# EAGLE schematic uDJV_board_2_v1.1 (EAGLE 9.3.1)

## Sheet 1 of 5
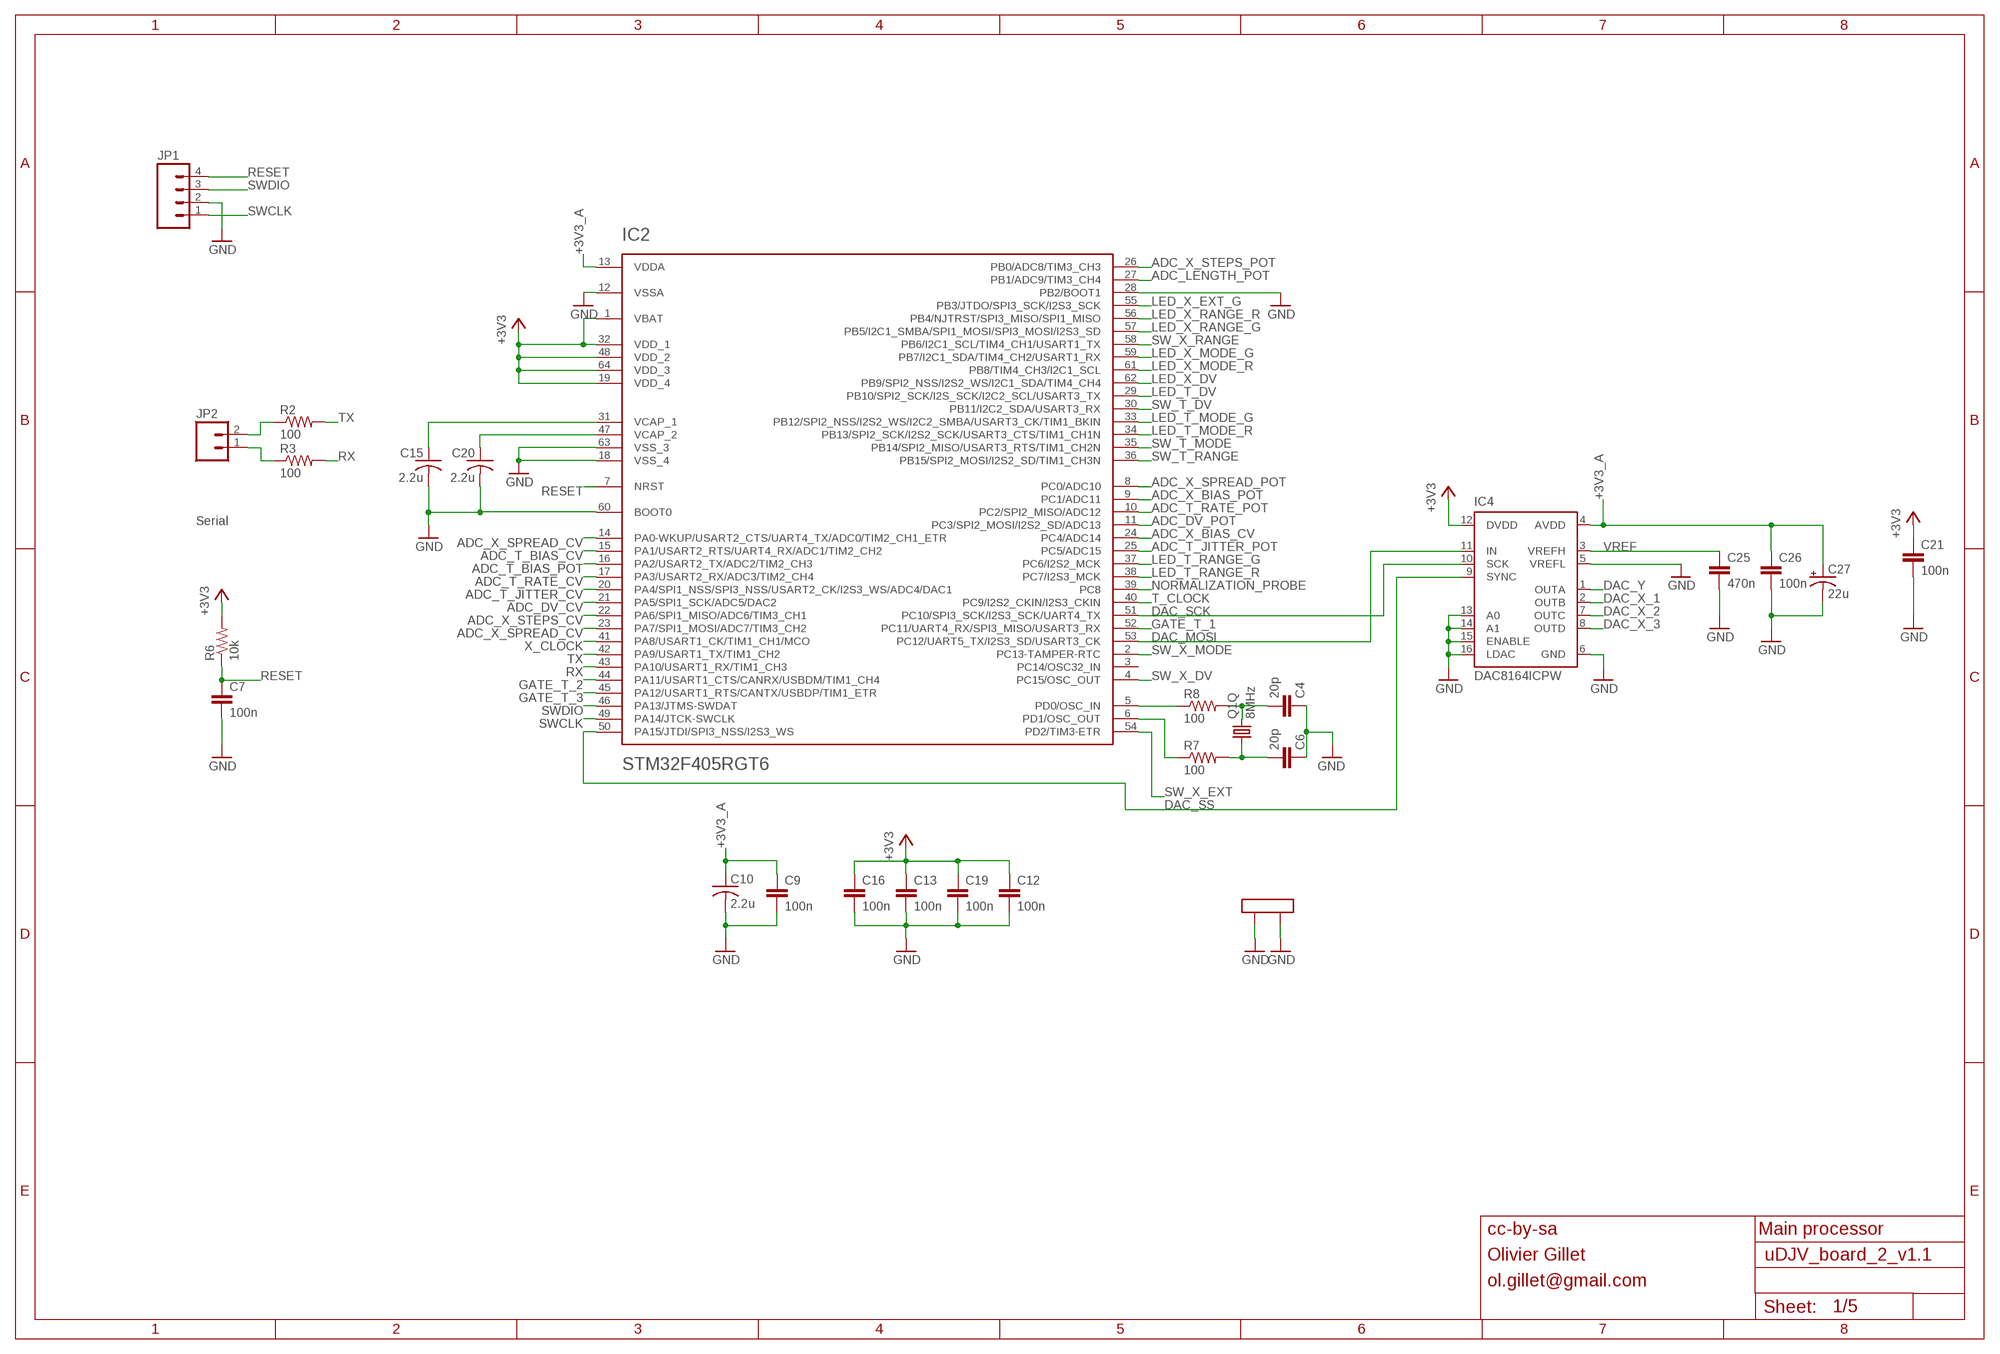
[diagram p0: schematic, sheet 1]

### Parts
C4  20p  PARTS_AMAN_CAPACITOR  [PARTS_AMAN_RESISTOR_0603]
C6  20p  PARTS_AMAN_CAPACITOR  [PARTS_AMAN_RESISTOR_0603]
C7  100n  PARTS_AMAN_CAPACITOR  [PARTS_AMAN_RESISTOR_0603]
C9  100n  PARTS_AMAN_CAPACITOR  [PARTS_AMAN_RESISTOR_0603]
C10  2.2u  C-USC0805  [C0805]
C12  100n  PARTS_AMAN_CAPACITOR  [PARTS_AMAN_RESISTOR_0603]
C13  100n  PARTS_AMAN_CAPACITOR  [PARTS_AMAN_RESISTOR_0603]
C15  2.2u  C-USC0805  [C0805]
C16  100n  PARTS_AMAN_CAPACITOR  [PARTS_AMAN_RESISTOR_0603]
C19  100n  PARTS_AMAN_CAPACITOR  [PARTS_AMAN_RESISTOR_0603]
C20  2.2u  C-USC0805  [C0805]
C21  100n  PARTS_AMAN_CAPACITOR  [PARTS_AMAN_RESISTOR_0603]
C25  470n  PARTS_AMAN_CAPACITOR  [PARTS_AMAN_RESISTOR_0603]
C26  100n  PARTS_AMAN_CAPACITOR  [PARTS_AMAN_RESISTOR_0603]
C27  22u  CPOL-USC  [PANASONIC_C]
IC2  STM32F405RGT6  STM32F20X  [TQFP-10X10-64]
IC4  DAC8164ICPW  DAC8564  [SOP65P640X110-16N]
JP1  M04PTH  [1X04]
JP2  M02PTH  [1X02]
Q1  8MHz  CRYSTAL  [CTS406]
R2  100  PARTS_AMAN_RESISTOR  [PARTS_AMAN_RESISTOR_0603]
R3  100  PARTS_AMAN_RESISTOR  [PARTS_AMAN_RESISTOR_0603]
R6  10k  PARTS_AMAN_RESISTOR  [PARTS_AMAN_RESISTOR_0603]
R7  100  PARTS_AMAN_RESISTOR  [PARTS_AMAN_RESISTOR_0603]
R8  100  PARTS_AMAN_RESISTOR  [PARTS_AMAN_RESISTOR_0603]

### Nets
+3V3: C12.1 C13.1 C16.1 C19.1 C21.1 IC2.1(VBAT) IC2.19(VDD_4) IC2.32(VDD_1) IC2.48(VDD_2) IC2.64(VDD_3) IC4.12(DVDD) R6.2 ; also sheet 3,5
+3V3_A: C9.1 C10.1 C26.1 C27.+ IC2.13(VDDA) IC4.4(AVDD) ; also sheet 2,3,5
ADC_DV_CV: IC2.21(PA5/SPI1_SCK/ADC5/DAC2) ; also sheet 3
ADC_DV_POT: IC2.11(PC3/SPI2_MOSI/I2S2_SD/ADC13) ; also sheet 2
ADC_LENGTH_POT: IC2.27(PB1/ADC9/TIM3_CH4) ; also sheet 2
ADC_T_BIAS_CV: IC2.15(PA1/USART2_RTS/UART4_RX/ADC1/TIM2_CH2) ; also sheet 3
ADC_T_BIAS_POT: IC2.16(PA2/USART2_TX/ADC2/TIM2_CH3) ; also sheet 2
ADC_T_JITTER_CV: IC2.20(PA4/SPI1_NSS/SPI3_NSS/USART2_CK/I2S3_WS/ADC4/DAC1) ; also sheet 3
ADC_T_JITTER_POT: IC2.25(PC5/ADC15) ; also sheet 2
ADC_T_RATE_CV: IC2.17(PA3/USART2_RX/ADC3/TIM2_CH4) ; also sheet 3
ADC_T_RATE_POT: IC2.10(PC2/SPI2_MISO/ADC12) ; also sheet 2
ADC_X_BIAS_CV: IC2.24(PC4/ADC14) ; also sheet 3
ADC_X_BIAS_POT: IC2.9(PC1/ADC11) ; also sheet 2
ADC_X_SPREAD_CV: IC2.14(PA0-WKUP/USART2_CTS/UART4_TX/ADC0/TIM2_CH1_ETR) IC2.23(PA7/SPI1_MOSI/ADC7/TIM3_CH2) ; also sheet 3
ADC_X_SPREAD_POT: IC2.8(PC0/ADC10) ; also sheet 2
ADC_X_STEPS_CV: IC2.22(PA6/SPI1_MISO/ADC6/TIM3_CH1) ; also sheet 3
ADC_X_STEPS_POT: IC2.26(PB0/ADC8/TIM3_CH3) ; also sheet 2
DAC_MOSI: IC2.53(PC12/UART5_TX/I2S3_SD/USART3_CK) IC4.11(IN)
DAC_SCK: IC2.51(PC10/SPI3_SCK/I2S3_SCK/UART4_TX) IC4.10(SCK)
DAC_SS: IC2.50(PA15/JTDI/SPI3_NSS/I2S3_WS) IC4.9(SYNC)
DAC_X_1: IC4.2(OUTB) ; also sheet 4
DAC_X_2: IC4.7(OUTC) ; also sheet 4
DAC_X_3: IC4.8(OUTD) ; also sheet 4
DAC_Y: IC4.1(OUTA) ; also sheet 4
GATE_T_1: IC2.52(PC11/UART4_RX/SPI3_MISO/USART3_RX) ; also sheet 4
GATE_T_2: IC2.44(PA11/USART1_CTS/CANRX/USBDM/TIM1_CH4) ; also sheet 4
GATE_T_3: IC2.45(PA12/USART1_RTS/CANTX/USBDP/TIM1_ETR) ; also sheet 4
GND: C4.1 C6.1 C7.2 C9.2 C10.2 C12.2 C13.2 C15.2 C16.2 C19.2 C20.2 C21.2 C25.2 C26.2 C27.- IC2.12(VSSA) IC2.18(VSS_4) IC2.28(PB2/BOOT1) IC2.60(BOOT0) IC2.63(VSS_3) IC4.5(VREFL) IC4.6(GND) IC4.13(A0) IC4.14(A1) IC4.15(ENABLE) IC4.16(LDAC) JP1.2 Q1.2(LID1) Q1.4(LID2) ; also sheet 2,3,4,5
LED_T_DV: IC2.29(PB10/SPI2_SCK/I2S_SCK/I2C2_SCL/USART3_TX) ; also sheet 2
LED_T_MODE_G: IC2.33(PB12/SPI2_NSS/I2S2_WS/I2C2_SMBA/USART3_CK/TIM1_BKIN) ; also sheet 2
LED_T_MODE_R: IC2.34(PB13/SPI2_SCK/I2S2_SCK/USART3_CTS/TIM1_CH1N) ; also sheet 2
LED_T_RANGE_G: IC2.37(PC6/I2S2_MCK) ; also sheet 2
LED_T_RANGE_R: IC2.38(PC7/I2S3_MCK) ; also sheet 2
LED_X_DV: IC2.62(PB9/SPI2_NSS/I2S2_WS/I2C1_SDA/TIM4_CH4) ; also sheet 2
LED_X_EXT_G: IC2.55(PB3/JTDO/SPI3_SCK/I2S3_SCK) ; also sheet 2
LED_X_MODE_G: IC2.59(PB7/I2C1_SDA/TIM4_CH2/USART1_RX) ; also sheet 2
LED_X_MODE_R: IC2.61(PB8/TIM4_CH3/I2C1_SCL) ; also sheet 2
LED_X_RANGE_G: IC2.57(PB5/I2C1_SMBA/SPI1_MOSI/SPI3_MOSI/I2S3_SD) ; also sheet 2
LED_X_RANGE_R: IC2.56(PB4/NJTRST/SPI3_MISO/SPI1_MISO) ; also sheet 2
N$7: IC2.6(PD1/OSC_OUT) R7.1
N$8: IC2.5(PD0/OSC_IN) R8.1
N$13: C20.1 IC2.47(VCAP_2)
N$19: C15.1 IC2.31(VCAP_1)
N$33: JP2.2 R2.1
N$51: JP2.1 R3.1
N$62: C4.2 Q1.3 R8.2
N$65: C6.2 Q1.1 R7.2
NORMALIZATION_PROBE: IC2.39(PC8) ; also sheet 3
RESET: C7.1 IC2.7(NRST) JP1.4 R6.1
RX: IC2.43(PA10/USART1_RX/TIM1_CH3) R3.2
SW_T_DV: IC2.30(PB11/I2C2_SDA/USART3_RX) ; also sheet 2
SW_T_MODE: IC2.35(PB14/SPI2_MISO/USART3_RTS/TIM1_CH2N) ; also sheet 2
SW_T_RANGE: IC2.36(PB15/SPI2_MOSI/I2S2_SD/TIM1_CH3N) ; also sheet 2
SW_X_DV: IC2.4(PC15/OSC_OUT) ; also sheet 2
SW_X_EXT: IC2.54(PD2/TIM3-ETR) ; also sheet 2
SW_X_MODE: IC2.2(PC13-TAMPER-RTC) ; also sheet 2
SW_X_RANGE: IC2.58(PB6/I2C1_SCL/TIM4_CH1/USART1_TX) ; also sheet 2
SWCLK: IC2.49(PA14/JTCK-SWCLK) JP1.1
SWDIO: IC2.46(PA13/JTMS-SWDAT) JP1.3
T_CLOCK: IC2.40(PC9/I2S2_CKIN/I2S3_CKIN) ; also sheet 3
TX: IC2.42(PA9/USART1_TX/TIM1_CH2) R2.2
VREF: C25.1 IC4.3(VREFH) ; also sheet 4
X_CLOCK: IC2.41(PA8/USART1_CK/TIM1_CH1/MCO) ; also sheet 3
Unconnected: IC2.3(PC14/OSC32_IN)

### Notes on the sheet
- Serial
- cc-by-sa | Main processor
- Olivier Gillet
- ol.gillet@gmail.com

## Sheet 2 of 5
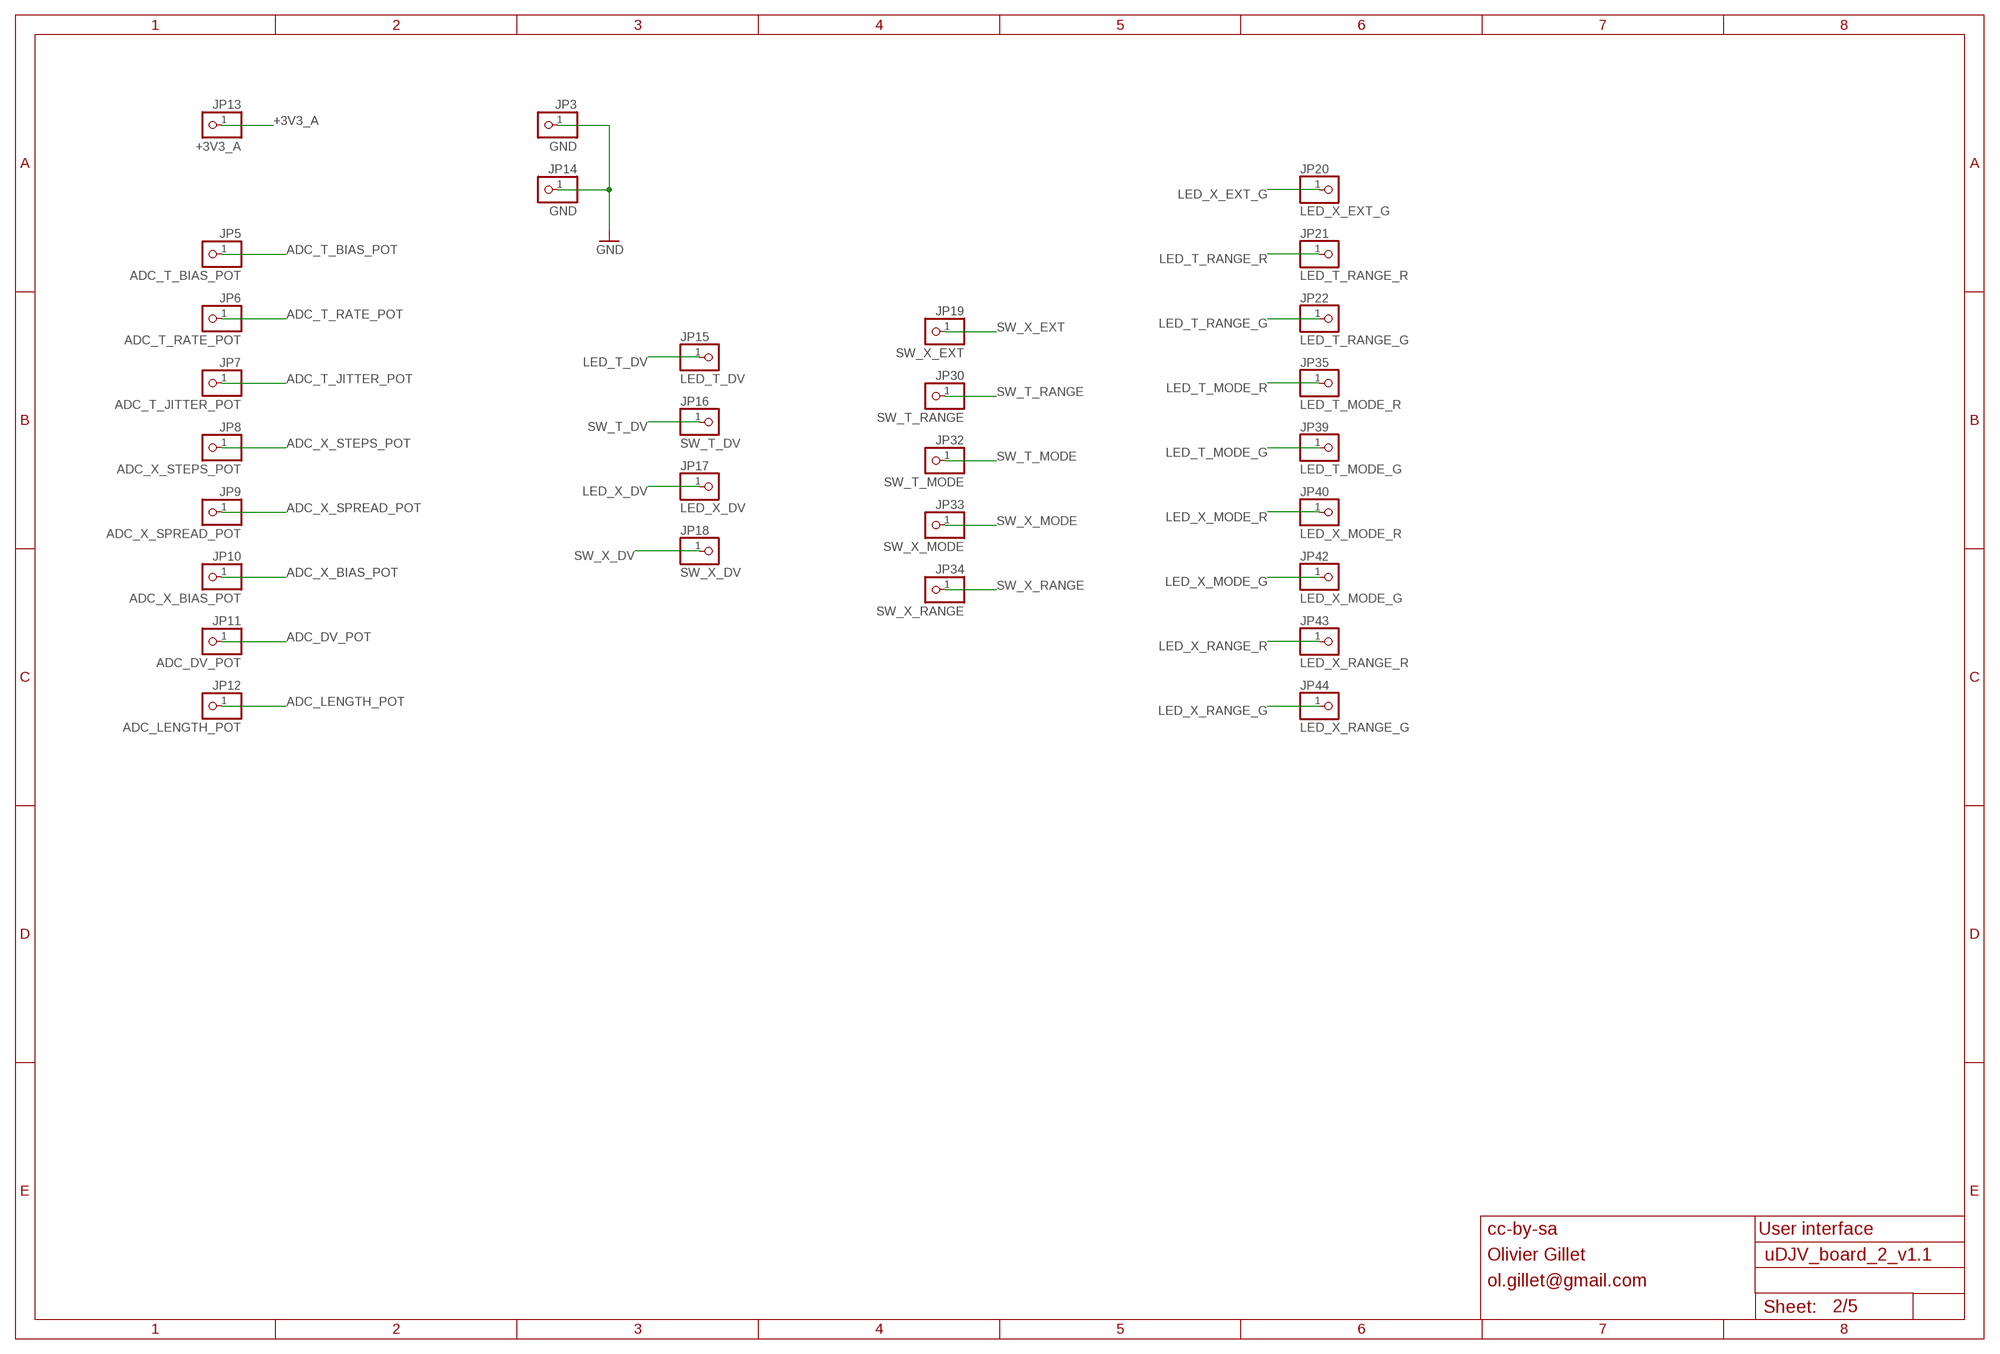
[diagram p1: schematic, sheet 2]

### Parts
JP3  GND  PARTS_AMAN_PINHD-1X1  [PARTS_AMAN_1X01]
JP5  ADC_T_BIAS_POT  PARTS_AMAN_PINHD-1X1  [PARTS_AMAN_1X01]
JP6  ADC_T_RATE_POT  PARTS_AMAN_PINHD-1X1  [PARTS_AMAN_1X01]
JP7  ADC_T_JITTER_POT  PARTS_AMAN_PINHD-1X1  [PARTS_AMAN_1X01]
JP8  ADC_X_STEPS_POT  PARTS_AMAN_PINHD-1X1  [PARTS_AMAN_1X01]
JP9  ADC_X_SPREAD_POT  PARTS_AMAN_PINHD-1X1  [PARTS_AMAN_1X01]
JP10  ADC_X_BIAS_POT  PARTS_AMAN_PINHD-1X1  [PARTS_AMAN_1X01]
JP11  ADC_DV_POT  PARTS_AMAN_PINHD-1X1  [PARTS_AMAN_1X01]
JP12  ADC_LENGTH_POT  PARTS_AMAN_PINHD-1X1  [PARTS_AMAN_1X01]
JP13  +3V3_A  PARTS_AMAN_PINHD-1X1  [PARTS_AMAN_1X01]
JP14  GND  PARTS_AMAN_PINHD-1X1  [PARTS_AMAN_1X01]
JP15  LED_T_DV  PARTS_AMAN_PINHD-1X1  [PARTS_AMAN_1X01]
JP16  SW_T_DV  PARTS_AMAN_PINHD-1X1  [PARTS_AMAN_1X01]
JP17  LED_X_DV  PARTS_AMAN_PINHD-1X1  [PARTS_AMAN_1X01]
JP18  SW_X_DV  PARTS_AMAN_PINHD-1X1  [PARTS_AMAN_1X01]
JP19  SW_X_EXT  PARTS_AMAN_PINHD-1X1  [PARTS_AMAN_1X01]
JP20  LED_X_EXT_G  PARTS_AMAN_PINHD-1X1  [PARTS_AMAN_1X01]
JP21  LED_T_RANGE_R  PARTS_AMAN_PINHD-1X1  [PARTS_AMAN_1X01]
JP22  LED_T_RANGE_G  PARTS_AMAN_PINHD-1X1  [PARTS_AMAN_1X01]
JP30  SW_T_RANGE  PARTS_AMAN_PINHD-1X1  [PARTS_AMAN_1X01]
JP32  SW_T_MODE  PARTS_AMAN_PINHD-1X1  [PARTS_AMAN_1X01]
JP33  SW_X_MODE  PARTS_AMAN_PINHD-1X1  [PARTS_AMAN_1X01]
JP34  SW_X_RANGE  PARTS_AMAN_PINHD-1X1  [PARTS_AMAN_1X01]
JP35  LED_T_MODE_R  PARTS_AMAN_PINHD-1X1  [PARTS_AMAN_1X01]
JP39  LED_T_MODE_G  PARTS_AMAN_PINHD-1X1  [PARTS_AMAN_1X01]
JP40  LED_X_MODE_R  PARTS_AMAN_PINHD-1X1  [PARTS_AMAN_1X01]
JP42  LED_X_MODE_G  PARTS_AMAN_PINHD-1X1  [PARTS_AMAN_1X01]
JP43  LED_X_RANGE_R  PARTS_AMAN_PINHD-1X1  [PARTS_AMAN_1X01]
JP44  LED_X_RANGE_G  PARTS_AMAN_PINHD-1X1  [PARTS_AMAN_1X01]

### Nets
+3V3_A: JP13.1 ; also sheet 1,3,5
ADC_DV_POT: JP11.1 ; also sheet 1
ADC_LENGTH_POT: JP12.1 ; also sheet 1
ADC_T_BIAS_POT: JP5.1 ; also sheet 1
ADC_T_JITTER_POT: JP7.1 ; also sheet 1
ADC_T_RATE_POT: JP6.1 ; also sheet 1
ADC_X_BIAS_POT: JP10.1 ; also sheet 1
ADC_X_SPREAD_POT: JP9.1 ; also sheet 1
ADC_X_STEPS_POT: JP8.1 ; also sheet 1
GND: JP3.1 JP14.1 ; also sheet 1,3,4,5
LED_T_DV: JP15.1 ; also sheet 1
LED_T_MODE_G: JP39.1 ; also sheet 1
LED_T_MODE_R: JP35.1 ; also sheet 1
LED_T_RANGE_G: JP22.1 ; also sheet 1
LED_T_RANGE_R: JP21.1 ; also sheet 1
LED_X_DV: JP17.1 ; also sheet 1
LED_X_EXT_G: JP20.1 ; also sheet 1
LED_X_MODE_G: JP42.1 ; also sheet 1
LED_X_MODE_R: JP40.1 ; also sheet 1
LED_X_RANGE_G: JP44.1 ; also sheet 1
LED_X_RANGE_R: JP43.1 ; also sheet 1
SW_T_DV: JP16.1 ; also sheet 1
SW_T_MODE: JP32.1 ; also sheet 1
SW_T_RANGE: JP30.1 ; also sheet 1
SW_X_DV: JP18.1 ; also sheet 1
SW_X_EXT: JP19.1 ; also sheet 1
SW_X_MODE: JP33.1 ; also sheet 1
SW_X_RANGE: JP34.1 ; also sheet 1

### Notes on the sheet
- cc-by-sa | User interface
- Olivier Gillet
- ol.gillet@gmail.com

## Sheet 3 of 5
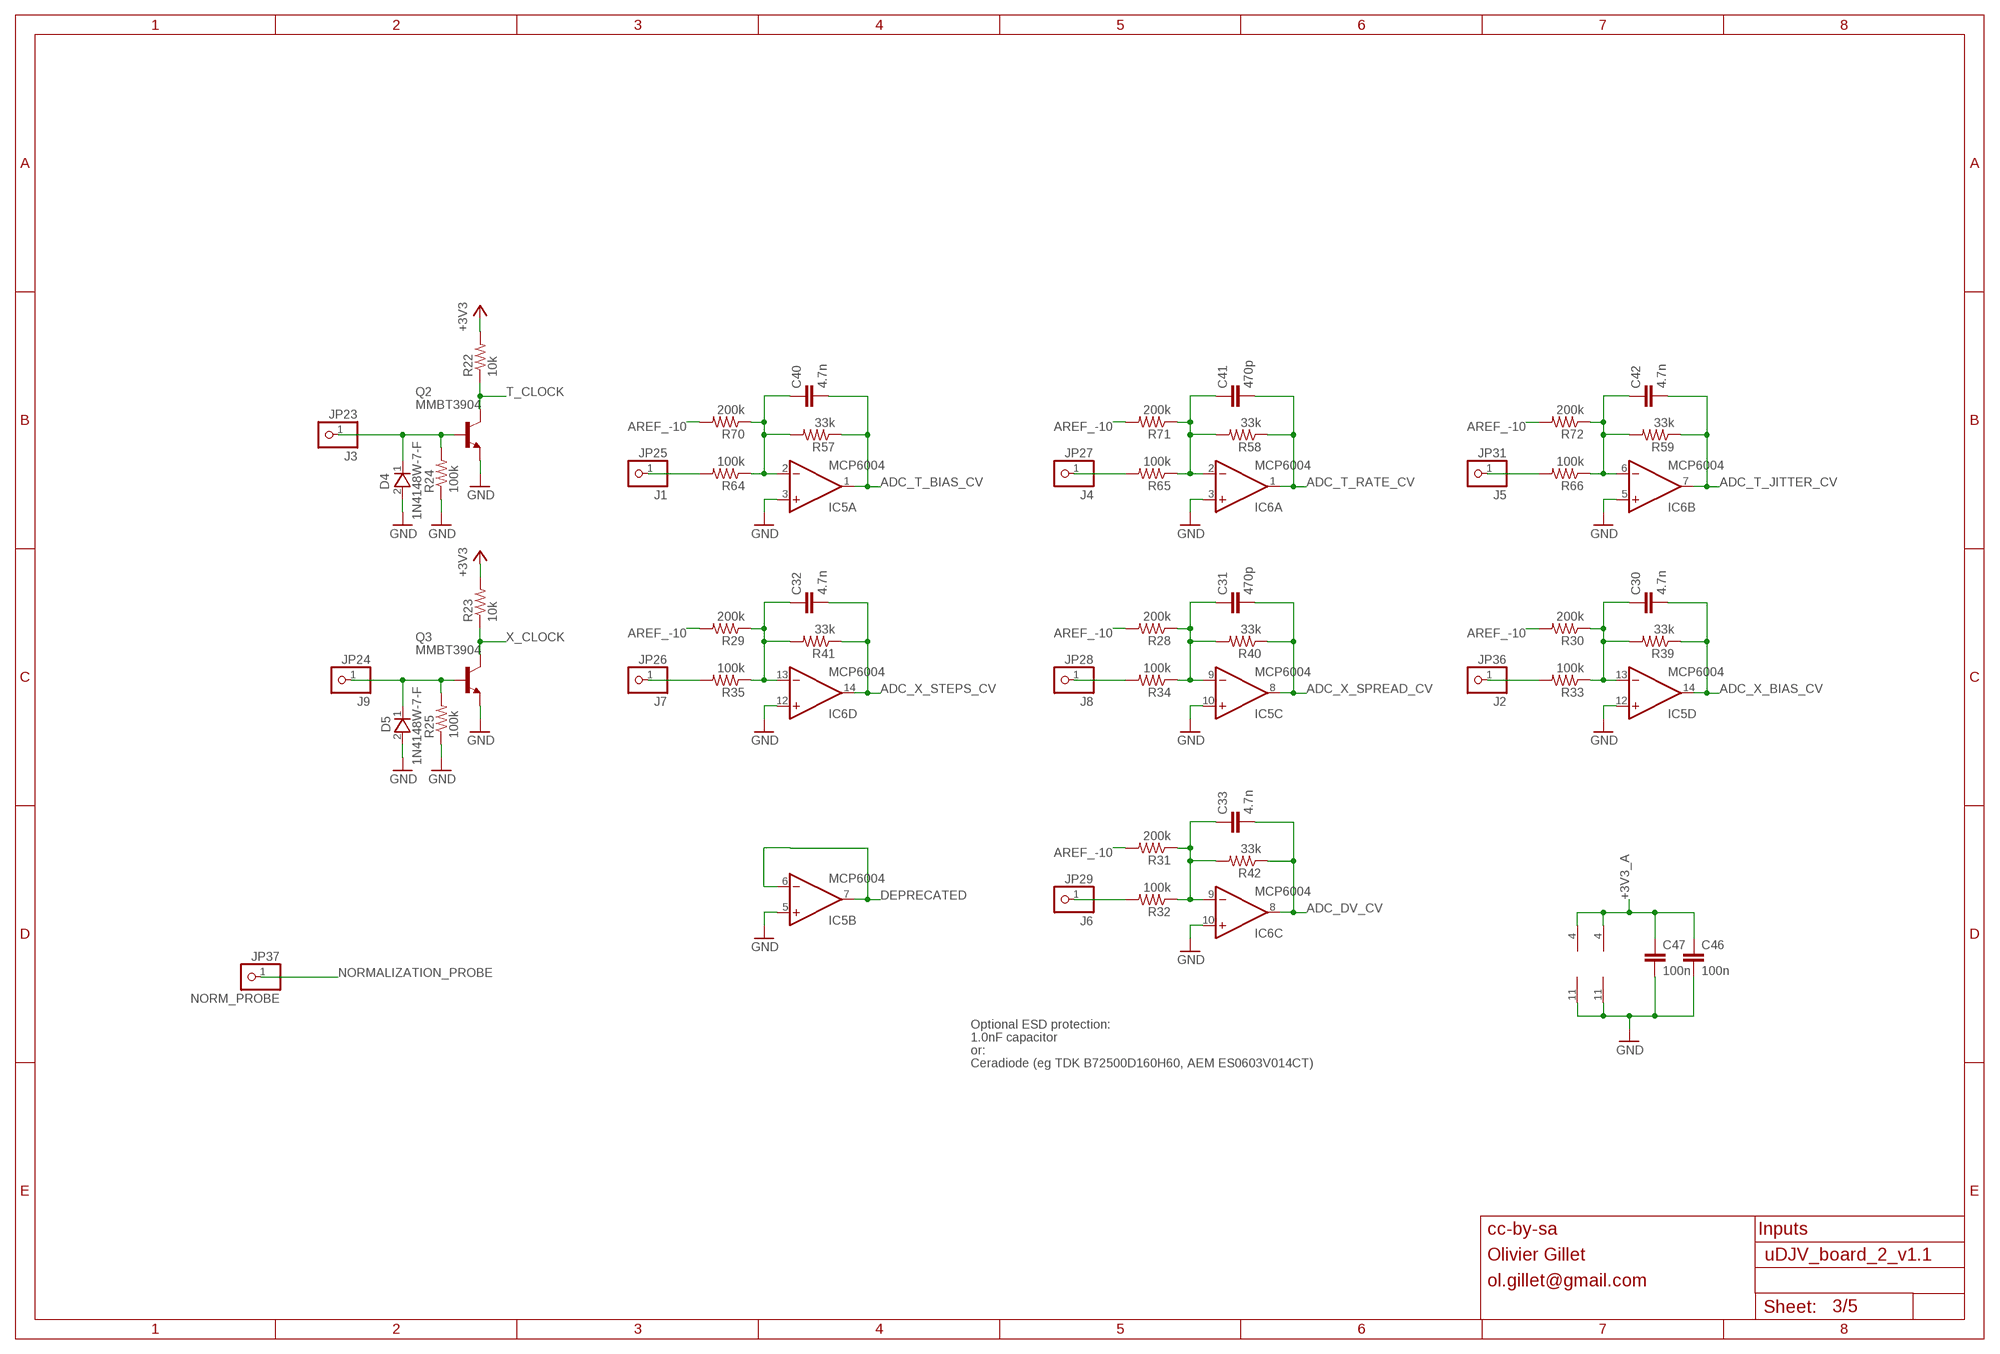
[diagram p2: schematic, sheet 3]

### Parts
C30  4.7n  PARTS_AMAN_CAPACITOR  [PARTS_AMAN_RESISTOR_0603]
C31  470p  PARTS_AMAN_CAPACITOR  [PARTS_AMAN_RESISTOR_0603]
C32  4.7n  PARTS_AMAN_CAPACITOR  [PARTS_AMAN_RESISTOR_0603]
C33  4.7n  PARTS_AMAN_CAPACITOR  [PARTS_AMAN_RESISTOR_0603]
C40  4.7n  PARTS_AMAN_CAPACITOR  [PARTS_AMAN_RESISTOR_0603]
C41  470p  PARTS_AMAN_CAPACITOR  [PARTS_AMAN_RESISTOR_0603]
C42  4.7n  PARTS_AMAN_CAPACITOR  [PARTS_AMAN_RESISTOR_0603]
C46  100n  PARTS_AMAN_CAPACITOR  [PARTS_AMAN_RESISTOR_0603]
C47  100n  PARTS_AMAN_CAPACITOR  [PARTS_AMAN_RESISTOR_0603]
D4  1N4148W-7-F  [SOD3716X115N]
D5  1N4148W-7-F  [SOD3716X115N]
IC5  MCP6004  TL074PW  [TSSOP14_065]
IC6  MCP6004  TL074PW  [TSSOP14_065]
JP23  J3  PARTS_AMAN_PINHD-1X1  [PARTS_AMAN_1X01]
JP24  J9  PARTS_AMAN_PINHD-1X1  [PARTS_AMAN_1X01]
JP25  J1  PARTS_AMAN_PINHD-1X1  [PARTS_AMAN_1X01]
JP26  J7  PARTS_AMAN_PINHD-1X1  [PARTS_AMAN_1X01]
JP27  J4  PARTS_AMAN_PINHD-1X1  [PARTS_AMAN_1X01]
JP28  J8  PARTS_AMAN_PINHD-1X1  [PARTS_AMAN_1X01]
JP29  J6  PARTS_AMAN_PINHD-1X1  [PARTS_AMAN_1X01]
JP31  J5  PARTS_AMAN_PINHD-1X1  [PARTS_AMAN_1X01]
JP36  J2  PARTS_AMAN_PINHD-1X1  [PARTS_AMAN_1X01]
JP37  NORM_PROBE  PARTS_AMAN_PINHD-1X1  [PARTS_AMAN_1X01]
Q2  MMBT3904  MMBT3904LT1-NPN-SOT23-BEC  [SOT23-BEC]
Q3  MMBT3904  MMBT3904LT1-NPN-SOT23-BEC  [SOT23-BEC]
R22  10k  PARTS_AMAN_RESISTOR  [PARTS_AMAN_RESISTOR_0603]
R23  10k  PARTS_AMAN_RESISTOR  [PARTS_AMAN_RESISTOR_0603]
R24  100k  PARTS_AMAN_RESISTOR  [PARTS_AMAN_RESISTOR_0603]
R25  100k  PARTS_AMAN_RESISTOR  [PARTS_AMAN_RESISTOR_0603]
R28  200k  PARTS_AMAN_RESISTOR  [PARTS_AMAN_RESISTOR_0603]
R29  200k  PARTS_AMAN_RESISTOR  [PARTS_AMAN_RESISTOR_0603]
R30  200k  PARTS_AMAN_RESISTOR  [PARTS_AMAN_RESISTOR_0603]
R31  200k  PARTS_AMAN_RESISTOR  [PARTS_AMAN_RESISTOR_0603]
R32  100k  PARTS_AMAN_RESISTOR  [PARTS_AMAN_RESISTOR_0603]
R33  100k  PARTS_AMAN_RESISTOR  [PARTS_AMAN_RESISTOR_0603]
R34  100k  PARTS_AMAN_RESISTOR  [PARTS_AMAN_RESISTOR_0603]
R35  100k  PARTS_AMAN_RESISTOR  [PARTS_AMAN_RESISTOR_0603]
R39  33k  PARTS_AMAN_RESISTOR  [PARTS_AMAN_RESISTOR_0603]
R40  33k  PARTS_AMAN_RESISTOR  [PARTS_AMAN_RESISTOR_0603]
R41  33k  PARTS_AMAN_RESISTOR  [PARTS_AMAN_RESISTOR_0603]
R42  33k  PARTS_AMAN_RESISTOR  [PARTS_AMAN_RESISTOR_0603]
R57  33k  PARTS_AMAN_RESISTOR  [PARTS_AMAN_RESISTOR_0603]
R58  33k  PARTS_AMAN_RESISTOR  [PARTS_AMAN_RESISTOR_0603]
R59  33k  PARTS_AMAN_RESISTOR  [PARTS_AMAN_RESISTOR_0603]
R64  100k  PARTS_AMAN_RESISTOR  [PARTS_AMAN_RESISTOR_0603]
R65  100k  PARTS_AMAN_RESISTOR  [PARTS_AMAN_RESISTOR_0603]
R66  100k  PARTS_AMAN_RESISTOR  [PARTS_AMAN_RESISTOR_0603]
R70  200k  PARTS_AMAN_RESISTOR  [PARTS_AMAN_RESISTOR_0603]
R71  200k  PARTS_AMAN_RESISTOR  [PARTS_AMAN_RESISTOR_0603]
R72  200k  PARTS_AMAN_RESISTOR  [PARTS_AMAN_RESISTOR_0603]

### Nets
+3V3: R22.2 R23.2 ; also sheet 1,5
+3V3_A: C46.1 C47.1 IC5.4(P:V+) IC6.4(P:V+) ; also sheet 1,2,5
ADC_DV_CV: C33.2 IC6.8(C:OUT) R42.1 ; also sheet 1
ADC_T_BIAS_CV: C40.2 IC5.1(A:OUT) R57.1 ; also sheet 1
ADC_T_JITTER_CV: C42.2 IC6.7(B:OUT) R59.1 ; also sheet 1
ADC_T_RATE_CV: C41.2 IC6.1(A:OUT) R58.1 ; also sheet 1
ADC_X_BIAS_CV: C30.2 IC5.14(D:OUT) R39.1 ; also sheet 1
ADC_X_SPREAD_CV: C31.2 IC5.8(C:OUT) R40.1 ; also sheet 1
ADC_X_STEPS_CV: C32.2 IC6.14(D:OUT) R41.1 ; also sheet 1
AREF_-10: R28.2 R29.2 R30.2 R31.2 R70.2 R71.2 R72.2 ; also sheet 5
DEPRECATED: IC5.6(B:-IN) IC5.7(B:OUT)
GND: C46.2 C47.2 D4.2(A) D5.2(A) IC5.3(A:+IN) IC5.5(B:+IN) IC5.10(C:+IN) IC5.11(P:V-) IC5.12(D:+IN) IC6.3(A:+IN) IC6.5(B:+IN) IC6.10(C:+IN) IC6.11(P:V-) IC6.12(D:+IN) Q2.E Q3.E R24.1 R25.1 ; also sheet 1,2,4,5
MORPH_IN: JP25.1 R64.2
MORPH_IN1: JP26.1 R35.2
MORPH_IN3: JP27.1 R65.2
MORPH_IN4: JP28.1 R34.2
MORPH_IN5: JP29.1 R32.2
MORPH_IN6: JP31.1 R66.2
MORPH_IN7: JP36.1 R33.2
N$5: C41.1 IC6.2(A:-IN) R58.2 R65.1 R71.1
N$11: C40.1 IC5.2(A:-IN) R57.2 R64.1 R70.1
N$15: C42.1 IC6.6(B:-IN) R59.2 R66.1 R72.1
N$17: C31.1 IC5.9(C:-IN) R28.1 R34.1 R40.2
N$25: C30.1 IC5.13(D:-IN) R30.1 R33.1 R39.2
N$27: C32.1 IC6.13(D:-IN) R29.1 R35.1 R41.2
N$31: C33.1 IC6.9(C:-IN) R31.1 R32.1 R42.2
N$50: D4.1(K) JP23.1 Q2.B R24.2
N$52: D5.1(K) JP24.1 Q3.B R25.2
NORMALIZATION_PROBE: JP37.1 ; also sheet 1
T_CLOCK: Q2.C R22.1 ; also sheet 1
X_CLOCK: Q3.C R23.1 ; also sheet 1

### Notes on the sheet
- Optional ESD protection:
- 1.0nF capacitor
- or:
- Ceradiode (eg TDK B72500D160H60, AEM ES0603V014CT)
- cc-by-sa | Inputs
- Olivier Gillet
- ol.gillet@gmail.com

## Sheet 4 of 5
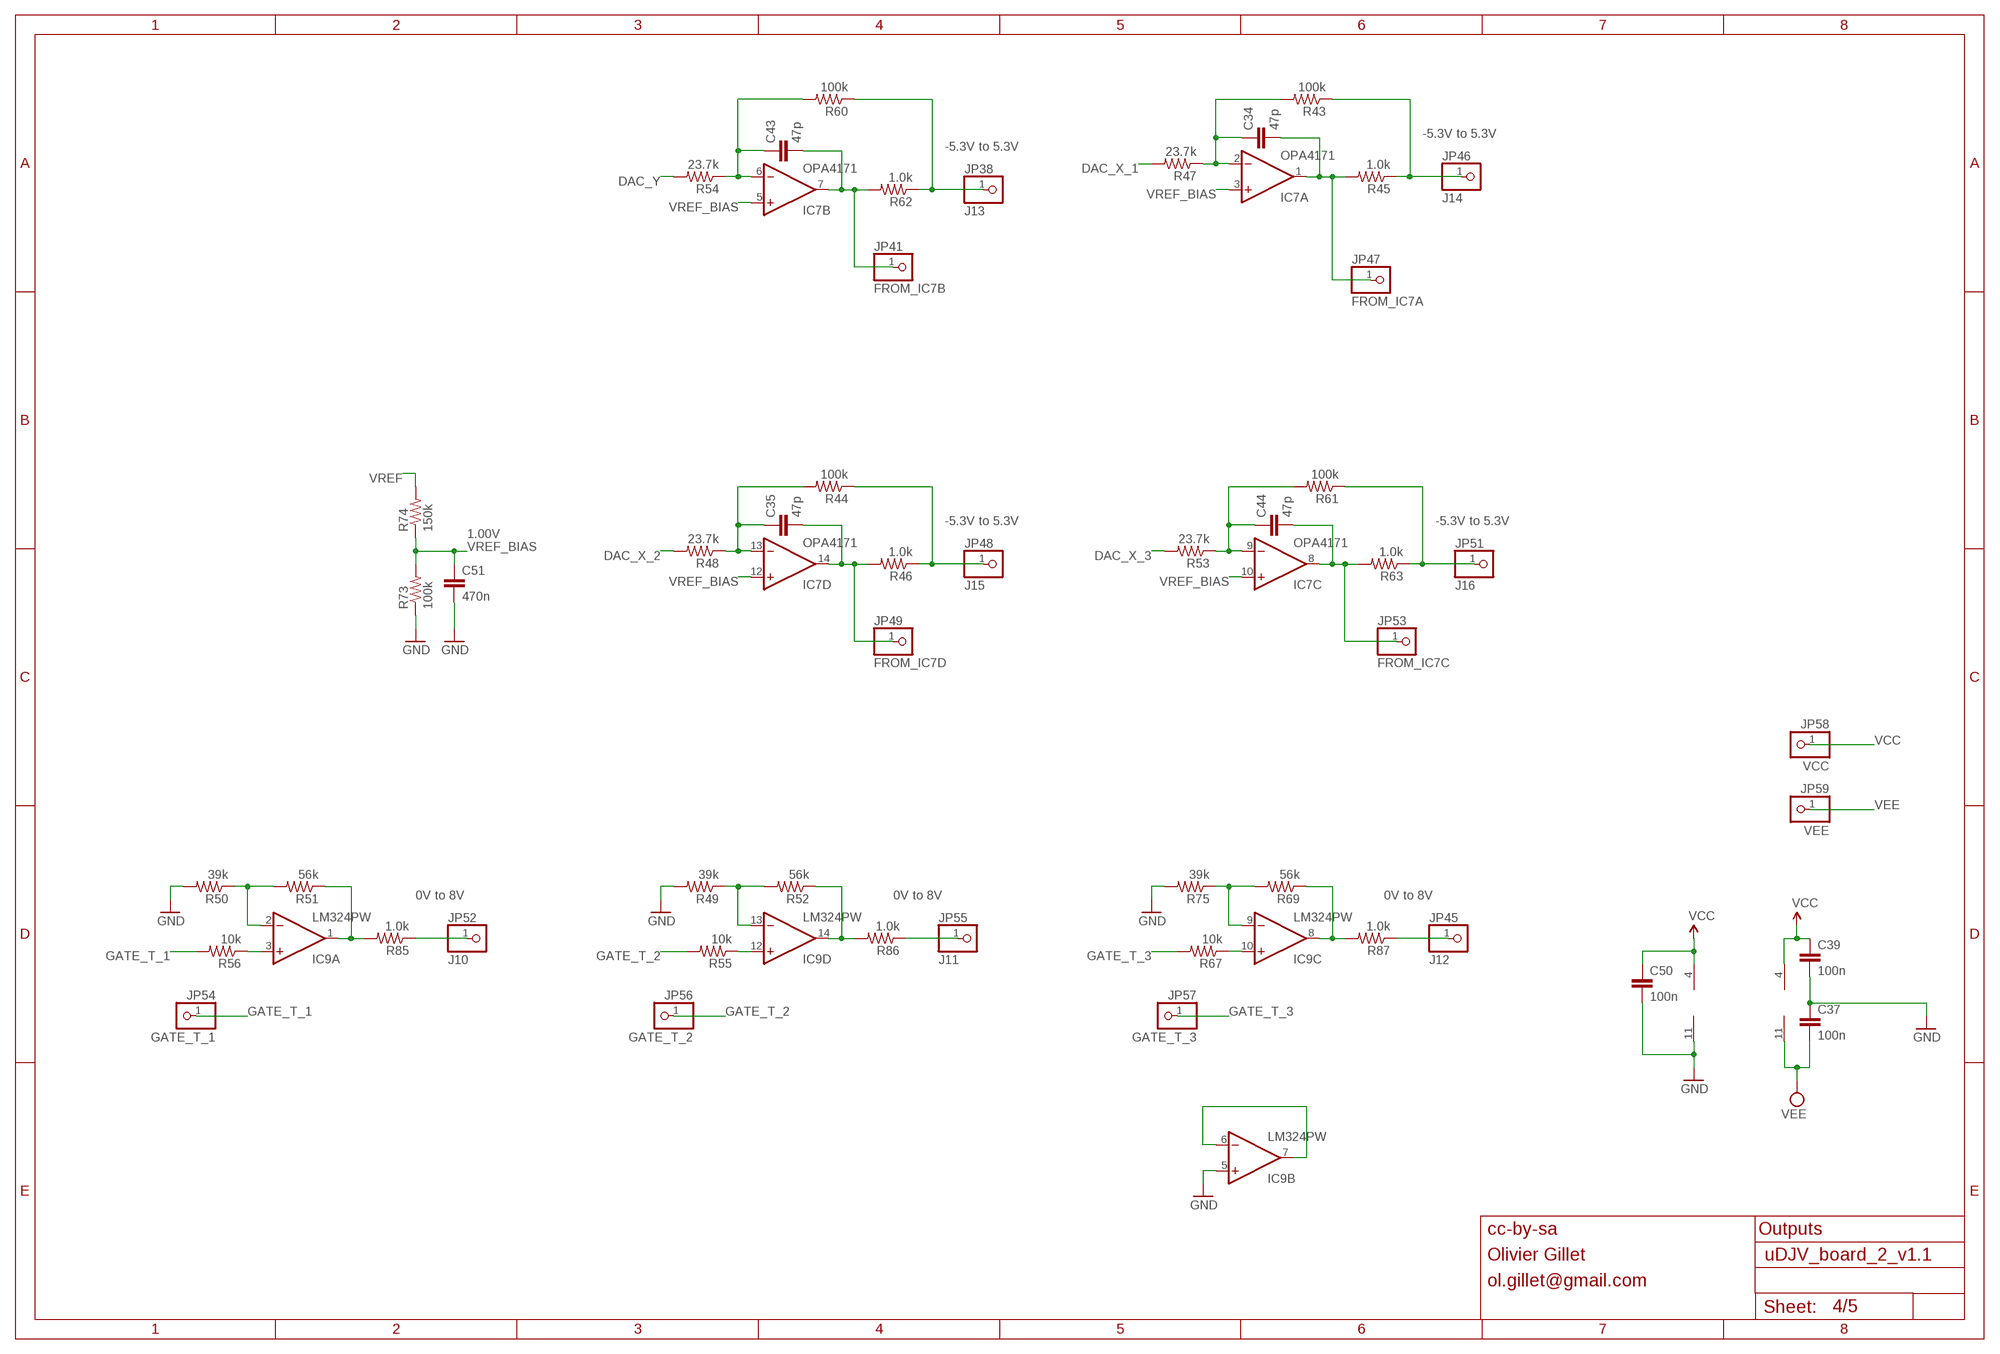
[diagram p3: schematic, sheet 4]

### Parts
C34  47p  PARTS_AMAN_CAPACITOR  [PARTS_AMAN_RESISTOR_0603]
C35  47p  PARTS_AMAN_CAPACITOR  [PARTS_AMAN_RESISTOR_0603]
C37  100n  PARTS_AMAN_CAPACITOR  [PARTS_AMAN_RESISTOR_0603]
C39  100n  PARTS_AMAN_CAPACITOR  [PARTS_AMAN_RESISTOR_0603]
C43  47p  PARTS_AMAN_CAPACITOR  [PARTS_AMAN_RESISTOR_0603]
C44  47p  PARTS_AMAN_CAPACITOR  [PARTS_AMAN_RESISTOR_0603]
C50  100n  PARTS_AMAN_CAPACITOR  [PARTS_AMAN_RESISTOR_0603]
C51  470n  PARTS_AMAN_CAPACITOR  [PARTS_AMAN_RESISTOR_0603]
IC7  OPA4171  TL074PW  [TSSOP14_065]
IC9  LM324PW  TL074PW  [TSSOP14_065]
JP38  J13  PARTS_AMAN_PINHD-1X1  [PARTS_AMAN_1X01]
JP41  FROM_IC7B  PARTS_AMAN_PINHD-1X1  [PARTS_AMAN_1X01]
JP45  J12  PARTS_AMAN_PINHD-1X1  [PARTS_AMAN_1X01]
JP46  J14  PARTS_AMAN_PINHD-1X1  [PARTS_AMAN_1X01]
JP47  FROM_IC7A  PARTS_AMAN_PINHD-1X1  [PARTS_AMAN_1X01]
JP48  J15  PARTS_AMAN_PINHD-1X1  [PARTS_AMAN_1X01]
JP49  FROM_IC7D  PARTS_AMAN_PINHD-1X1  [PARTS_AMAN_1X01]
JP51  J16  PARTS_AMAN_PINHD-1X1  [PARTS_AMAN_1X01]
JP52  J10  PARTS_AMAN_PINHD-1X1  [PARTS_AMAN_1X01]
JP53  FROM_IC7C  PARTS_AMAN_PINHD-1X1  [PARTS_AMAN_1X01]
JP54  GATE_T_1  PARTS_AMAN_PINHD-1X1  [PARTS_AMAN_1X01]
JP55  J11  PARTS_AMAN_PINHD-1X1  [PARTS_AMAN_1X01]
JP56  GATE_T_2  PARTS_AMAN_PINHD-1X1  [PARTS_AMAN_1X01]
JP57  GATE_T_3  PARTS_AMAN_PINHD-1X1  [PARTS_AMAN_1X01]
JP58  VCC  PARTS_AMAN_PINHD-1X1  [PARTS_AMAN_1X01]
JP59  VEE  PARTS_AMAN_PINHD-1X1  [PARTS_AMAN_1X01]
R43  100k  PARTS_AMAN_RESISTOR  [PARTS_AMAN_RESISTOR_0603]
R44  100k  PARTS_AMAN_RESISTOR  [PARTS_AMAN_RESISTOR_0603]
R45  1.0k  PARTS_AMAN_RESISTOR  [PARTS_AMAN_RESISTOR_0603]
R46  1.0k  R-US_R0603  [R0603]
R47  23.7k  PARTS_AMAN_RESISTOR  [PARTS_AMAN_RESISTOR_0603]
R48  23.7k  PARTS_AMAN_RESISTOR  [PARTS_AMAN_RESISTOR_0603]
R49  39k  PARTS_AMAN_RESISTOR  [PARTS_AMAN_RESISTOR_0603]
R50  39k  PARTS_AMAN_RESISTOR  [PARTS_AMAN_RESISTOR_0603]
R51  56k  PARTS_AMAN_RESISTOR  [PARTS_AMAN_RESISTOR_0603]
R52  56k  PARTS_AMAN_RESISTOR  [PARTS_AMAN_RESISTOR_0603]
R53  23.7k  PARTS_AMAN_RESISTOR  [PARTS_AMAN_RESISTOR_0603]
R54  23.7k  PARTS_AMAN_RESISTOR  [PARTS_AMAN_RESISTOR_0603]
R55  10k  PARTS_AMAN_RESISTOR  [PARTS_AMAN_RESISTOR_0603]
R56  10k  PARTS_AMAN_RESISTOR  [PARTS_AMAN_RESISTOR_0603]
R60  100k  PARTS_AMAN_RESISTOR  [PARTS_AMAN_RESISTOR_0603]
R61  100k  PARTS_AMAN_RESISTOR  [PARTS_AMAN_RESISTOR_0603]
R62  1.0k  R-US_R0603  [R0603]
R63  1.0k  R-US_R0603  [R0603]
R67  10k  PARTS_AMAN_RESISTOR  [PARTS_AMAN_RESISTOR_0603]
R69  56k  PARTS_AMAN_RESISTOR  [PARTS_AMAN_RESISTOR_0603]
R73  100k  PARTS_AMAN_RESISTOR  [PARTS_AMAN_RESISTOR_0603]
R74  150k  PARTS_AMAN_RESISTOR  [PARTS_AMAN_RESISTOR_0603]
R75  39k  PARTS_AMAN_RESISTOR  [PARTS_AMAN_RESISTOR_0603]
R85  1.0k  R-US_R0603  [R0603]
R86  1.0k  R-US_R0603  [R0603]
R87  1.0k  R-US_R0603  [R0603]

### Nets
DAC_X_1: R47.2 ; also sheet 1
DAC_X_2: R48.2 ; also sheet 1
DAC_X_3: R53.2 ; also sheet 1
DAC_Y: R54.2 ; also sheet 1
GATE_T_1: JP54.1 R56.2 ; also sheet 1
GATE_T_2: JP56.1 R55.2 ; also sheet 1
GATE_T_3: JP57.1 R67.2 ; also sheet 1
GND: C37.1 C39.2 C50.2 C51.2 IC9.5(B:+IN) IC9.11(P:V-) R49.2 R50.2 R73.1 R75.2 ; also sheet 1,2,3,5
N$3: IC9.12(D:+IN) R55.1
N$14: IC9.1(A:OUT) R51.1 R85.2
N$24: JP52.1 R85.1
N$26: IC9.2(A:-IN) R50.1 R51.2
N$29: IC9.3(A:+IN) R56.1
N$30: IC9.6(B:-IN) IC9.7(B:OUT)
N$34: IC9.14(D:OUT) R52.1 R86.2
N$35: IC9.13(D:-IN) R49.1 R52.2
N$37: IC9.10(C:+IN) R67.1
N$38: IC9.8(C:OUT) R69.1 R87.2
N$39: JP55.1 R86.1
N$40: JP45.1 R87.1
N$41: IC9.9(C:-IN) R69.2 R75.1
N$45: C43.2 IC7.7(B:OUT) JP41.1 R62.2
N$49: JP48.1 R44.1 R46.1
N$53: JP38.1 R60.1 R62.1
N$54: C35.1 IC7.13(D:-IN) R44.2 R48.1
N$58: JP51.1 R61.1 R63.1
N$59: C44.1 IC7.9(C:-IN) R53.1 R61.2
N$60: C34.1 IC7.2(A:-IN) R43.2 R47.1
N$61: C43.1 IC7.6(B:-IN) R54.1 R60.2
N$63: JP46.1 R43.1 R45.1
N$70: C34.2 IC7.1(A:OUT) JP47.1 R45.2
N$73: C35.2 IC7.14(D:OUT) JP49.1 R46.2
N$76: C44.2 IC7.8(C:OUT) JP53.1 R63.2
VCC: C39.1 C50.1 IC7.4(P:V+) IC9.4(P:V+) JP58.1 ; also sheet 5
VEE: C37.2 IC7.11(P:V-) JP59.1 ; also sheet 5
VREF: R74.2 ; also sheet 1
VREF_BIAS: C51.1 IC7.3(A:+IN) IC7.5(B:+IN) IC7.10(C:+IN) IC7.12(D:+IN) R73.2 R74.1

### Notes on the sheet
- -5.3V to 5.3V
- -5.3V to 5.3V
- -5.3V to 5.3V | -5.3V to 5.3V
- 1.00V
- 0V to 8V | 0V to 8V | 0V to 8V
- cc-by-sa | Outputs
- Olivier Gillet
- ol.gillet@gmail.com

## Sheet 5 of 5
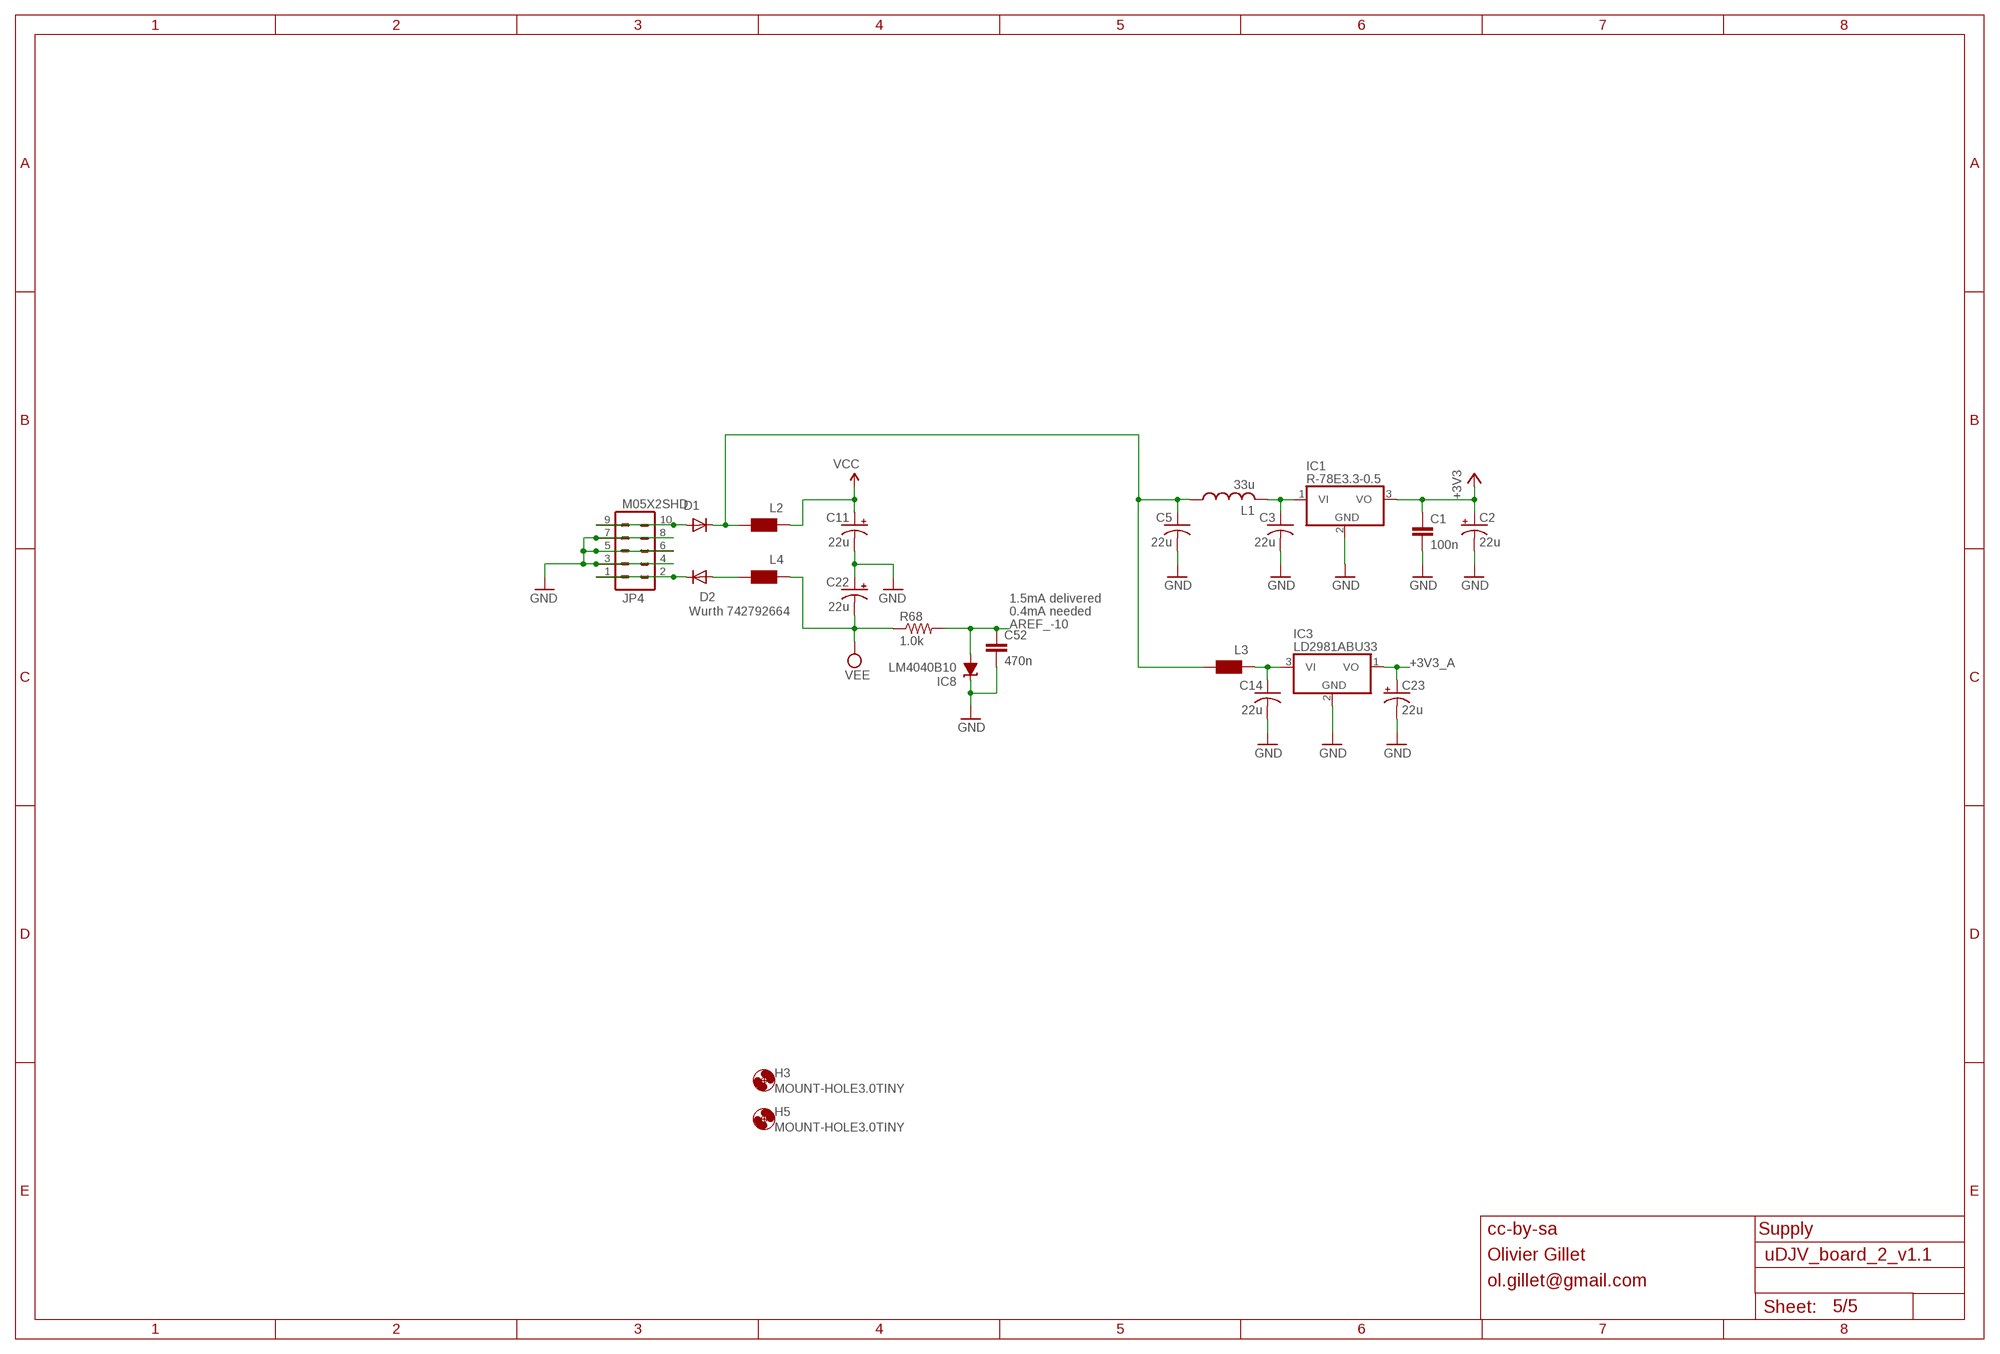
[diagram p4: schematic, sheet 5]

### Parts
C1  100n  PARTS_AMAN_CAPACITOR  [PARTS_AMAN_RESISTOR_0603]
C2  22u  CPOL-USC  [PANASONIC_C]
C3  22u  C-USC1206  [C1206]
C5  22u  C-USC1206  [C1206]
C11  22u  CPOL-USC  [PANASONIC_C]
C14  22u  C-USC1206  [C1206]
C22  22u  CPOL-USC  [PANASONIC_C]
C23  22u  CPOL-USC  [PANASONIC_C]
C52  470n  PARTS_AMAN_CAPACITOR  [PARTS_AMAN_RESISTOR_0603]
D1  1N5819HW  DIODE-SOD123  [SOD123]
D2  1N5819HW  DIODE-SOD123  [SOD123]
H3  MOUNT-HOLE3.0TINY  [3,0TINY]
H5  MOUNT-HOLE3.0TINY  [3,0TINY]
IC1  R-78E3.3-0.5  WE173950378  [WE78]
IC3  LD2981ABU33  LD2981ABU  [SOT89]
IC8  LM4040B10  LM4041B12DBZ  [DBZ_R-PDSO-G3]
JP4  M05X2SHD  [2X5-SHROUDED]
L1  33u  L-USL2012C  [L2012C]
L2  WE-CBF_0603  [0603]
L3  WE-CBF_0603  [0603]
L4  WE-CBF_0603  [0603]
R68  1.0k  PARTS_AMAN_RESISTOR  [PARTS_AMAN_RESISTOR_0603]

### Nets
+3V3: C1.1 C2.+ IC1.3(VO) ; also sheet 1,3
+3V3_A: C23.+ IC3.1(VO) ; also sheet 1,2,3
AREF_-10: C52.1 IC8.2(A) R68.2 ; also sheet 3
GND: C1.2 C2.- C3.2 C5.2 C11.- C14.2 C22.+ C23.- C52.2 IC1.2(GND) IC3.2(GND) IC8.1(C) JP4.3 JP4.4 JP4.5 JP4.6 JP4.7 JP4.8 ; also sheet 1,2,3,4
N$4: C14.1 IC3.3(VI) L3.1
N$6: C5.1 D1.C L1.1 L2.2 L3.2
N$10: D2.A L4.2
N$32: C3.1 IC1.1(VI) L1.2
N$56: D1.A JP4.9 JP4.10
N$64: D2.C JP4.1 JP4.2
VCC: C11.+ L2.1 ; also sheet 4
VEE: C22.- L4.1 R68.1 ; also sheet 4

### Notes on the sheet
- 1.5mA delivered
- Wurth 742792664 | 0.4mA needed
- cc-by-sa | Supply
- Olivier Gillet
- ol.gillet@gmail.com

## Library data of the parts
C1 C4 C6 C7 C9 C12 C13 C16 C19 C21 C25 C26 C30-C35 C37 C39-C44 C46 C47 C50-C52 = atom_v1_1_board_2:PARTS_AMAN_CAPACITOR
C2 C11 C22 C23 C27 = rcl:CPOL-US: POLARIZED CAPACITOR, American symbol
C3 C5 C10 C14 C15 C20 = rcl:C-US: CAPACITOR, American symbol
D1 D2 = diode:DIODE-: DIODE
D4 D5 = 1N4148W-7-F:1N4148W-7-F: Diode Switching 150mA 100V 400mW SOD123 Diodes Inc 1N4148W-7-F Switching Diode 100V, 2-Pin SOD-123 Source: Datasheet <https://componentsearchengine.com/Datasheets/2/1N4148W-7-F.pdf>; ALLIED_NUMBER: 71028125; ALLIED_PRICE-STOCK: https://www.alliedelec.com/diodes-inc-1n4148w-7-f/71028125/; DESCRIPTION: Diode Switching 150mA 100V 400mW SOD123 Diodes Inc 1N4148W-7-F Switching Diode 100V, 2-Pin SOD-123; HEIGHT: 1.15mm; MANUFACTURER_NAME: Diodes Inc.; MANUFACTURER_PART_NUMBER: 1N4148W-7-F; MOUSER_PART_NUMBER: 621-1N4148W-F; MOUSER_PRICE-STOCK: https://www.mouser.com/Search/Refine.aspx?Keyword=621-1N4148W-F; RS_PART_NUMBER: 7384728P; RS_PRICE-STOCK: http://uk.rs-online.com/web/p/products/7384728P
H3 H5 = og-holes:MOUNT-HOLE: MOUNTING HOLE with drill center marker
IC1 = og-vreg:WE173950378
IC2 = og-stm32f2:STM32F20X
IC3 = og-vreg:LD2981
IC4 = og-dac:DAC8564
IC5-IC7 IC9 = og-linear:TL074: OP AMP
IC8 = texas:LM4041: PRECISION MICROPOWER SHUNT VOLTAGE REFERENCE Source: http://focus.ti.com/lit/ds/slcs146e/slcs146e.pdf
JP1 = SparkFun:M04: Header 4 Standard 4-pin 0.1" header. Use with straight break away headers (SKU : PRT-00116), right angle break away headers (PRT-00553), swiss pins (PRT-00743), machine pins (PRT-00117), and female headers (PRT-00115). Molex polarized connector foot print use with SKU : PRT-08231 with associated crimp pins and housings.
JP2 = SparkFun:M02: Header 2 Standard 2-pin 0.1" header. Use with straight break away headers (SKU : PRT-00116), right angle break away headers (PRT-00553), swiss pins (PRT-00743), machine pins (PRT-00117), and female headers (PRT-00115). Molex polarized connector foot print use with SKU : PRT-08233 with associated crimp pins and housings.
JP3 JP5-JP49 JP51-JP59 = atom_v1_1_board_2:PARTS_AMAN_PINHD-1X1: PIN HEADER
JP4 = og-header:M05X2: Header 5x2 Standard 10-pin dual row 0.1" header. Commonly used with AVR-ISP. Use with Spark Fun Electronics SKU: PRT-00778
L1 = og-rcl:L-US
L2-L4 = wuerth-elektronik:WE-CBF: SMD EMI Suppression Ferrite Beads - excellent anti-EMI properties - low DCR - impedances till 3000 ohms - rated current up to 6 A
Q1 = og-crystal:CRYSTAL: Crystal with 2 extra terminals for the metal LID (Abracon ABMM2 for example)
Q2 Q3 = transistor:*-NPN-: NPN Transistror BF959 corrected 2008.03.06
R2 R3 R6-R8 R22-R25 R28-R35 R39-R45 R47-R61 R64-R75 = atom_v1_1_board_2:PARTS_AMAN_RESISTOR
R46 R62 R63 R85-R87 = rcl:R-US_: RESISTOR, American symbol